# EasyEDA schematic MRBR_2020-10-03_09-19-58.json
TITLE: Model Railroad Bluetooth Router; REV: 1.0; Date: 2020-09-22; Sheet: 1/1; Drawn By: Thibaut Delguste; Company: Manul
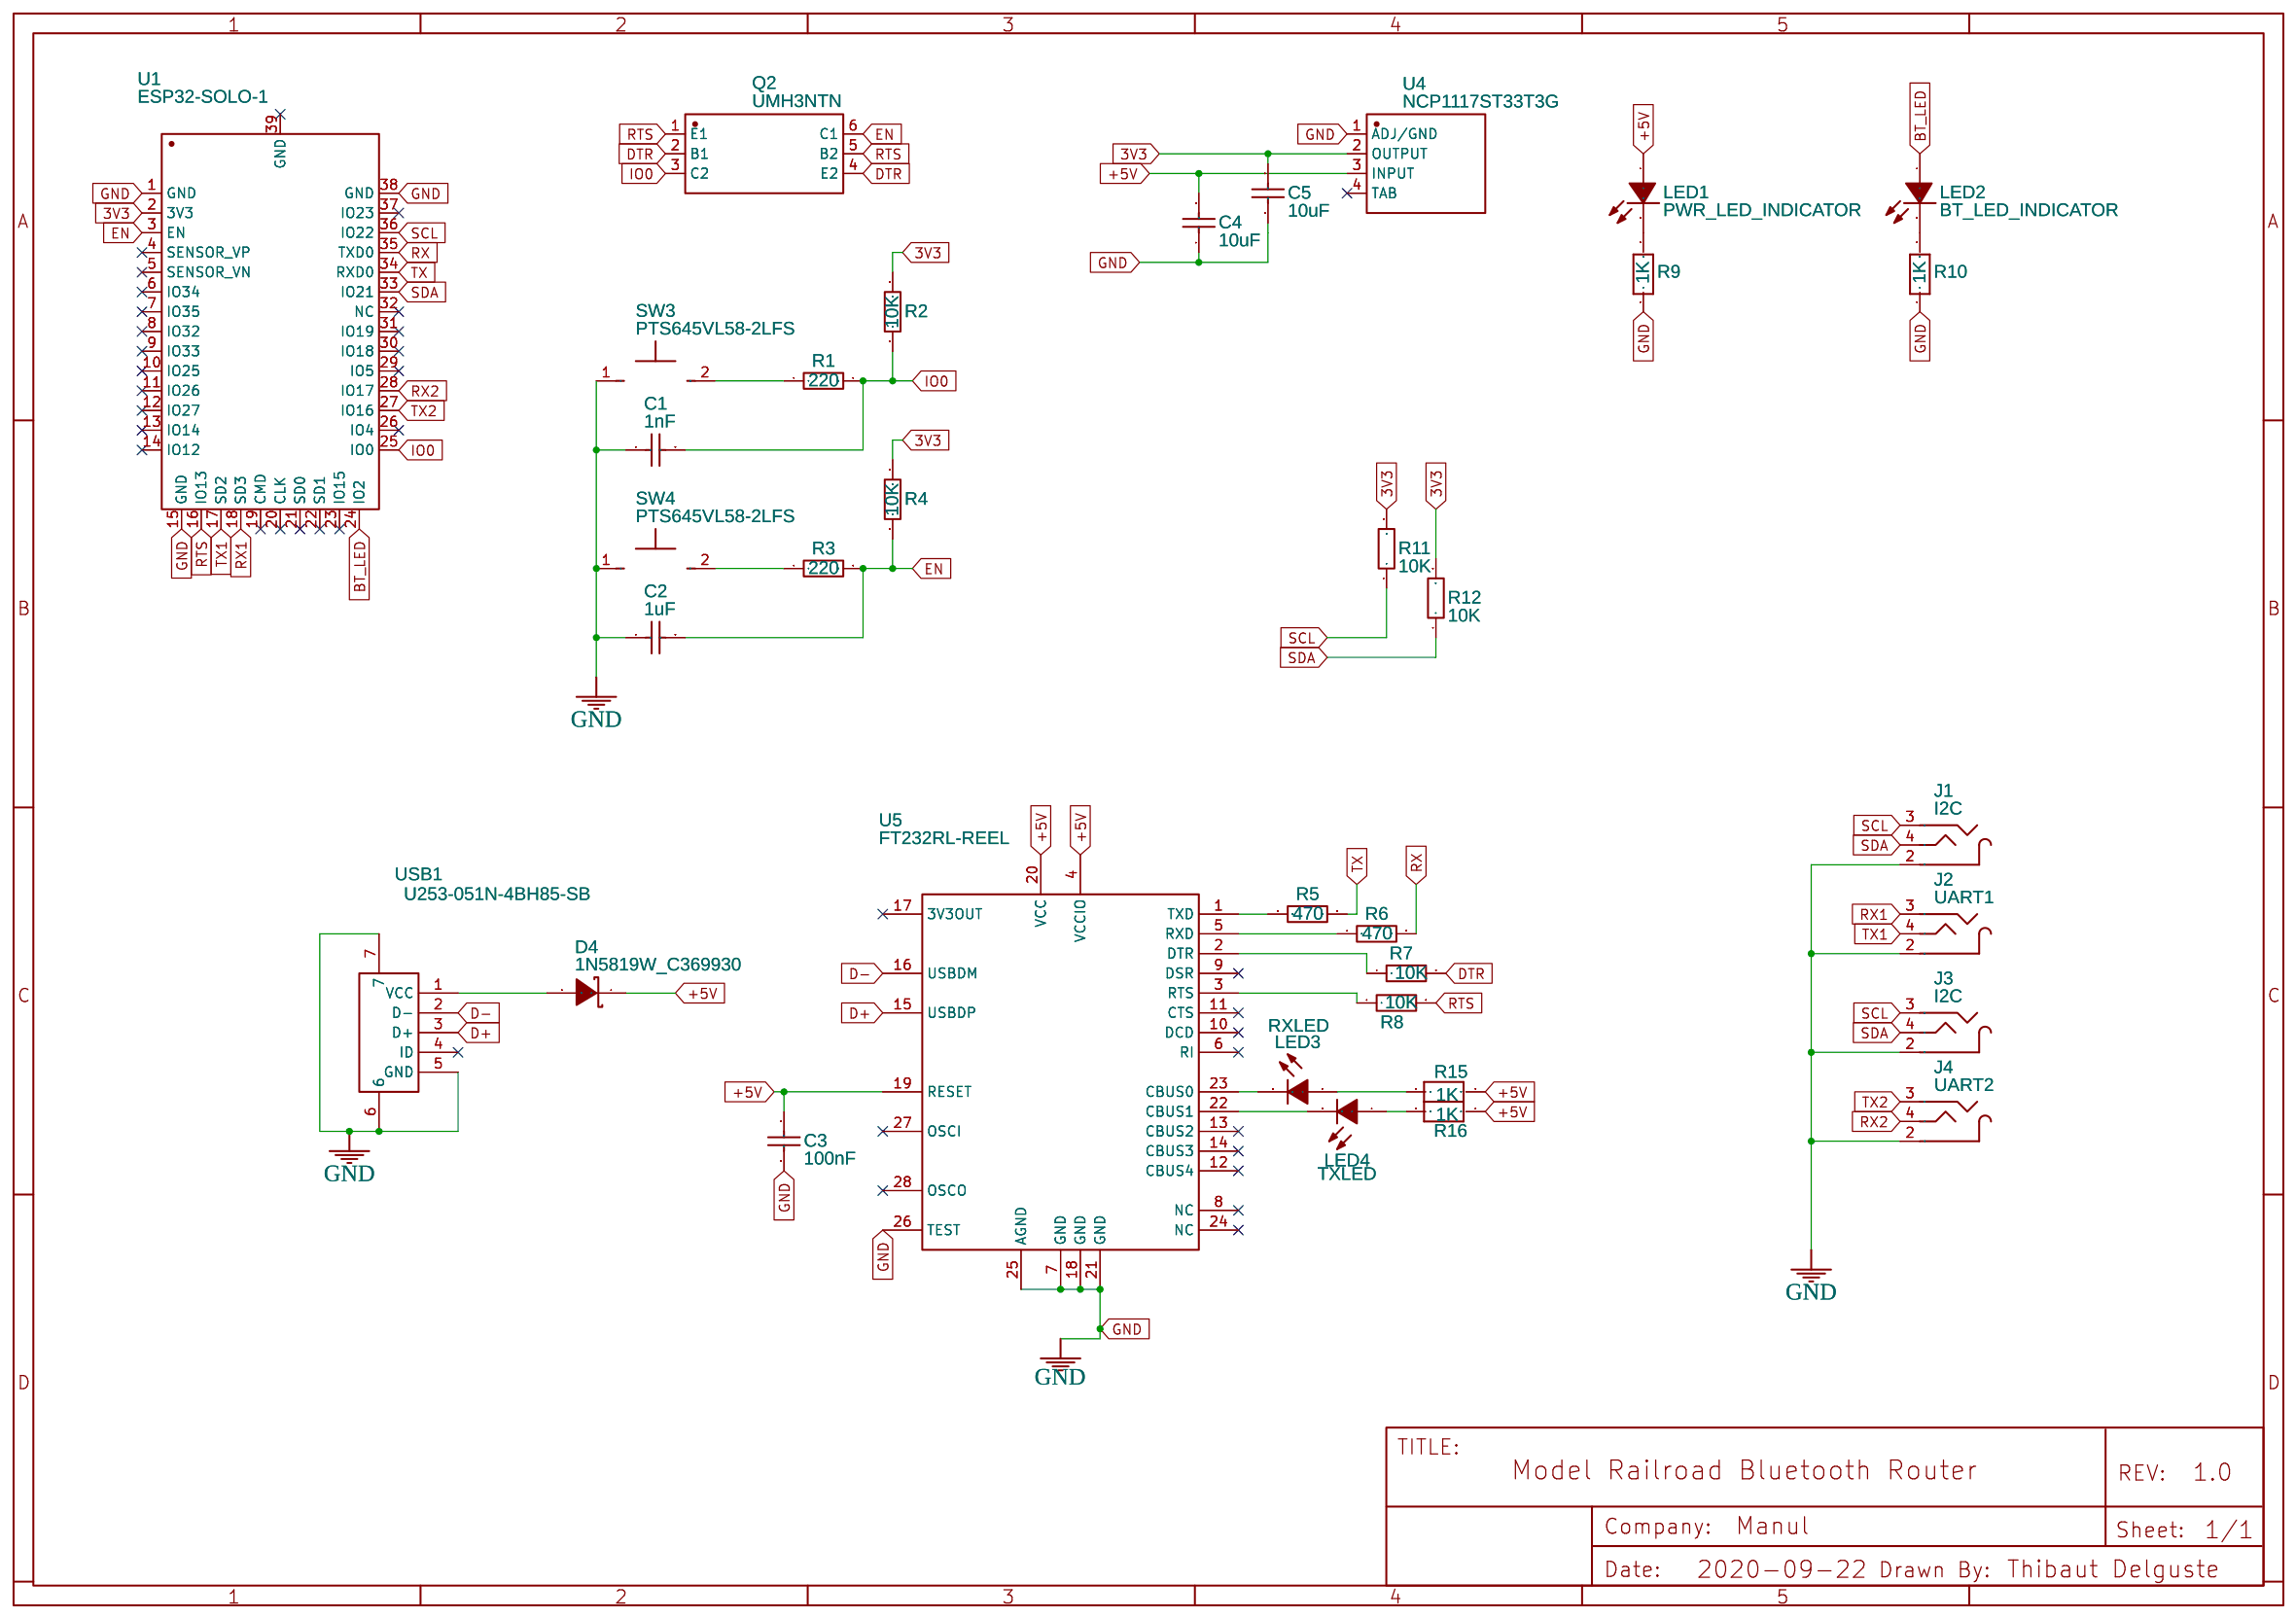
[diagram p0: schematic sheet]

## Parts
C1  1nF  [C1206]
C2  1uF  [C1206]
C3  100nF  [C1206]
C4  10uF  [C1206]
C5  10uF  [C1206]
D4  1N5819W_C369930  [SOD-123_L2.8-W1.8-LS3.7-RD]
J1  I2C  [AUDIO-TH_PJ313D]
J2  UART1  [AUDIO-TH_PJ313D]
J3  I2C  [AUDIO-TH_PJ313D]
J4  UART2  [AUDIO-TH_PJ313D]
LED1  PWR_LED_INDICATOR  [LED1206-R-RD]
LED2  BT_LED_INDICATOR  [LED1206-R-RD]
LED3  RXLED  [LED1206-R-RD]
LED4  TXLED  [LED1206-R-RD]
Q2  UMH3NTN  [SOT-363_L2.0-W1.3-P0.65-LS2.1-TL]
R1  220  [R1206]
R2  10K  [R1206]
R3  220  [R1206]
R4  10K  [R1206]
R5  470  [R1206]
R6  470  [R1206]
R7  10K  [R1206]
R8  10K  [R1206]
R9  1K  [_1206MP]
R10  1K  [_1206MP]
R11  10K  [R1206]
R12  10K  [R1206]
R15  1K  [_1206MP]
R16  1K  [_1206MP]
SW3  PTS645VL58-2LFS  [KEY-7.0*7.0]
SW4  PTS645VL58-2LFS  [KEY-7.0*7.0]
U1  ESP32-SOLO-1  [WIFIM-SMD_38P-L25.5-W18.0-P1.27]
U4  NCP1117ST33T3G  [SOT-223-3_L6.5-W3.4-P2.30-LS7.0-BR]
U5  FT232RL-REEL  [SSOP-28_L10.2-W5.3-P0.65-LS7.8-BL]
USB1  U253-051N-4BH85-SB  [MICRO-USB-SMD_U253-051T-4BH85-SB]

## Library data of the parts
C1 C2 = 1206B102K500NT: Supplier: LCSC; Manufacturer: FH; Supplier Part: C1845
C3 = CL31B104KBCNNNC: Supplier: LCSC; Manufacturer: SAMSUNG; LCSC Assembly: Yes; Supplier Part: C24497; SMT Type: Basic
C4 C5 = CL31A106KAHNNNE: Supplier: LCSC; Manufacturer: SAMSUNG; Supplier Part: C9807
D4 = 1N5819W_C369930: Supplier: LCSC; Supplier Part: C369930; Manufacturer: KEXIN; Manufacturer Part: 1N5819W; Contributor: LCSC; LCSC Assembly: Yes; SMT Type: Extend
J1-J4 = PJ313D: Supplier: LCSC; Manufacturer: BOOMELE; Supplier Part: C18167
LED1 LED2 = FC-3215HRK-620D: Supplier: LCSC; Manufacturer: NATIONSTAR; image: //image.lceda.cn/szlcsc/C84270.jpg; Supplier Part: C84270; LCSC Assembly: Yes; SMT Type: Extend
LED3 LED4 = 15-21SYGC/S530-E2/TR8: Supplier: LCSC; Manufacturer: EVERLIGHT; image: //image.lceda.cn/szlcsc/C73550.jpg; Supplier Part: C73550; LCSC Assembly: Yes; SMT Type: Extend
Q2 = UMH3NTN: Supplier: LCSC; Manufacturer: ROHM; Contributor: LCSC; Supplier Part: C123008; LCSC Assembly: Yes; SMT Type: Extend
R1 R3 = CR1206F42200G: Supplier: LCSC; Manufacturer: LIZ; Supplier Part: C102128
R2 R4 = 1206W4F1002T5E: Supplier: LCSC; Manufacturer: UniOhm; LCSC Assembly: Yes; Supplier Part: C17902; SMT Type: Basic
R5 R6 = RCT06470RFLF: Supplier: LCSC; Supplier Part: C185720; Manufacturer: Hong Kong Resistors; Contributor: LCSC
R7 R8 R11 R12 = 1206W4J0102T5E: Supplier: LCSC; Manufacturer: UniOhm; Supplier Part: C1469
R9 R10 R15 R16 = -: Contributor: otisbyron
SW3 SW4 = -: Supplier: LCSC; Supplier Part: C221892; Manufacturer: C&K; Contributor: LCSC
U1 = ESP32-SOLO-1: Supplier: LCSC; Supplier Part: C473005; Manufacturer: Espressif Systems; Contributor: LCSC
U4 = NCP1117ST33T3G: Supplier: LCSC; Manufacturer: ON; image: //image.lceda.cn/szlcsc/C26537.jpg; Supplier Part: C26537; LCSC Assembly: Yes; SMT Type: Extend
U5 = -: Supplier: LCSC; Manufacturer: FTDI; LCSC Assembly: Yes; image: //image.lceda.cn/szlcsc/C8690.jpg; Supplier Part: C8690; SMT Type: Basic
USB1 = U253-051N-4BH85-SB: Supplier: LCSC; Supplier Part: C319177; Manufacturer: XKB Enterprise; Contributor: LCSC

## Nets
3V3: C5.2 R2.2 R4.2 R11.2 R12.2 U1.2(3V3) U4.2(OUTPUT)
+5V: C3.2 C4.2 D4.1(K) LED1.1(A) R15.2 R16.2 U4.3(INPUT) U5.4(VCCIO) U5.19(RESET) U5.20(VCC)
GND: C1.1 C2.1 C3.1 C4.1 C5.1 J1.2 J2.2 J3.2 J4.2 R9.1 R10.1 SW3.1 SW4.1 U1.1(GND) U1.15(GND) U1.38(GND) U4.1(ADJ/GND) U5.7(GND) U5.18(GND) U5.21(GND) U5.25(AGND) U5.26(TEST) USB1.5(GND) USB1.6 USB1.7
BT_LED: LED2.1(A) U1.24(IO2)
D+: U5.15(USBDP) USB1.3(D+)
D-: U5.16(USBDM) USB1.2(D-)
DTR: Q2.2(B1) Q2.4(E2) R7.2
EN: C2.2 Q2.6(C1) R3.2 R4.1 U1.3(EN)
IO0: C1.2 Q2.3(C2) R1.2 R2.1 U1.25(IO0)
RTS: Q2.1(E1) Q2.5(B2) R8.2 U1.16(IO13)
RX: R6.2 U1.35(TXD0)
RX1: J2.3 U1.18(SD3)
RX2: J4.4 U1.28(IO17)
SCL: J1.3 J3.3 R11.1 U1.36(IO22)
SDA: J1.4 J3.4 R12.1 U1.33(IO21)
TX: R5.2 U1.34(RXD0)
TX1: J2.4 U1.17(SD2)
TX2: J4.3 U1.27(IO16)
Net-(D4-2): D4.2(A) USB1.1(VCC)
Net-(LED1-2): LED1.2(K) R9.2
Net-(LED2-2): LED2.2(K) R10.2
Net-(LED3-1): LED3.1(A) R15.1
Net-(LED3-2): LED3.2(C) U5.23(CBUS0)
Net-(LED4-1): LED4.1(A) R16.1
Net-(LED4-2): LED4.2(C) U5.22(CBUS1)
Net-(R1-1): R1.1 SW3.2
Net-(R3-1): R3.1 SW4.2
Net-(R5-1): R5.1 U5.1(TXD)
Net-(R6-1): R6.1 U5.5(RXD)
Net-(R7-1): R7.1 U5.2(DTR)
Net-(R8-1): R8.1 U5.3(RTS)

Not connected (* = marked no-connect by the designer): U1 4(SENSOR_VP)* 5(SENSOR_VN)* 6(IO34)* 7(IO35)* 8(IO32)* 9(IO33)* 10(IO25)* 11(IO26)* 12(IO27)* 13(IO14)* 14(IO12)* 19(CMD)* 20(CLK)* 21(SD0)* 22(SD1)* 23(IO15)* 26(IO4)* 29(IO5)* 30(IO18)* 31(IO19)* 32(NC)* 37(IO23)* 39(GND)*; U4 4(TAB)*; U5 6(RI)* 8(NC)* 9(DSR)* 10(DCD)* 11(CTS)* 12(CBUS4)* 13(CBUS2)* 14(CBUS3)* 17(3V3OUT)* 24(NC)* 27(OSCI)* 28(OSCO)*; USB1 4(ID)*
